# Altium schematic sheet 04 REGULATORS.SchDoc: REGULATORS
size 420 x 297 mm; SheetNumber: 4; SheetTotal: 4
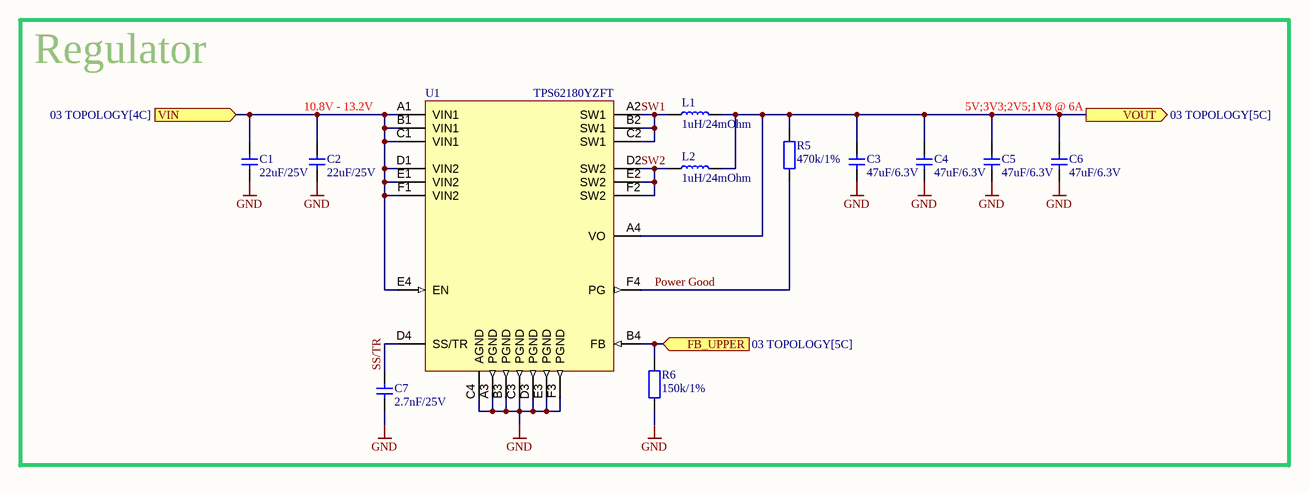
[diagram p0: 04 REGULATORS.SchDoc]

## Parts
C1  22uF/25V  [CAPC2012X14M]
C2  22uF/25V  [CAPC2012X14M]
C3  47uF/6.3V  [CAPC2012X14M]
C4  47uF/6.3V  [CAPC2012X14M]
C5  47uF/6.3V  [CAPC2012X14M]
C6  47uF/6.3V  [CAPC2012X14M]
C7  2.7nF/25V  [CAPC1005X07M]
L1  1uH/24mOhm  [INDP3030X20M]
L2  1uH/24mOhm  [INDP3030X20M]
R5  470k/1%  [RESC1005X04M]
R6  150k/1%  [RESC1005X04M]
U1  TPS62180YZFT  [BGA24C50P4X6_210X310X62]

## Ports
FB_UPPER (in, see 03 TOPOLOGY[5C]), VIN (in, see 03 TOPOLOGY[4C]), VOUT (out, see 03 TOPOLOGY[5C])

## Nets
GND: C1.1 C2.1 C3.1 C4.1 C5.1 C6.1 C7.1 R6.1 U1.A3(PGND) U1.B3(PGND) U1.C3(PGND) U1.C4(AGND) U1.D3(PGND) U1.E3(PGND) U1.F3(PGND)
FB_UPPER: R6.2 U1.B4(FB) ; port FB_UPPER
Power Good: R5.1 U1.F4(PG)
SS/TR: C7.2 U1.D4(SS/TR)
SW1: L1.1 U1.A2(SW1) U1.B2(SW1) U1.C2(SW1)
SW2: L2.1 U1.D2(SW2) U1.E2(SW2) U1.F2(SW2)
VIN: C1.2 C2.2 U1.A1(VIN1) U1.B1(VIN1) U1.C1(VIN1) U1.D1(VIN2) U1.E1(VIN2) U1.E4(EN) U1.F1(VIN2) ; port VIN
VOUT: C3.2 C4.2 C5.2 C6.2 L1.2 L2.2 R5.2 U1.A4(VO) ; port VOUT

## Notes on the sheet
- Regulator
- 10.8V - 13.2V
- 5V;3V3;2V5;1V8 @ 6A
- Title
- Project
- Size
- Date
- Revision
- A3
- Designed By

## Library data of the parts
C1 C2 = GRT21BR61E226ME13L: 22 µF ±20% 25V Ceramic Capacitor X5R 0805 (2012 Metric); ComponentLink1Description: Datasheet; ComponentLink1URL: https://search.murata.co.jp/Ceramy/image/img/A01X/G101/ENG/GRT21BR61E226ME13-01.pdf; MPN: GRT21BR61E226ME13L
C3-C6 = GRM188R60J476ME15D: 47 µF ±20% 6.3V Ceramic Capacitor X5R 0603 (1608 Metric); ComponentLink1Description: Datasheet; ComponentLink1URL: https://search.murata.co.jp/Ceramy/image/img/A01X/G101/ENG/GRM188R60J476ME15-01.pdf; MPN: GRM188R60J476ME15D
C7 = CC0402KRX7R8BB272: 2700 pF ±10% 25V Ceramic Capacitor X7R 0402 (1005 Metric); ComponentLink1Description: Datasheet; ComponentLink1URL: https://www.yageo.com/upload/media/product/productsearch/datasheet/mlcc/UPY-GPHC_X7R_6.3V-to-250V_23.pdf; MPN: CC0402KRX7R8BB272
L1 L2 = IHLP1212BZER1R0M11: 1 µH Shielded Molded Inductor 5 A 24mOhm Max Nonstandard; ComponentLink1Description: Datasheet; ComponentLink1URL: https://www.vishay.com/docs/34289/lp12bz11.pdf; MPN: IHLP1212BZER1R0M11
R5 = CRCW0402787KFKED_1RMCF0402FT470K: 470 kOhms ±1% 0.063W, 1/16W Chip Resistor 0402 (1005 Metric) Automotive AEC-Q200 Thick Film; ComponentLink1Description: Datasheet; ComponentLink1URL: https://www.seielect.com/Catalog/SEI-RMCF_RMCP.pdf; MPN: RMCF0402FT470K
R6 = CRCW0402150KFKED: 150 kOhms ±1% 0.063W, 1/16W Chip Resistor 0402 (1005 Metric) Automotive AEC-Q200 Thick Film; ComponentLink1Description: Datasheet; ComponentLink1URL: https://www.vishay.com/docs/20035/dcrcwe3.pdf; MPN: CRCW0402150KFKED
U1 = TPS62180YZFT: Buck Switching Regulator IC Positive Adjustable 0.9V 1 Output 6A 24-UFBGA, DSBGA; ComponentLink1Description: Datasheet; ComponentLink1URL: https://www.ti.com/general/docs/suppproductinfo.tsp?distId=10&gotoUrl=https%3A%2F%2Fwww.ti.com%2Flit%2Fgpn%2Ftps62180; MPN: TPS62180YZFT